# Altium schematic sheet Pg7-Power supply 2.SchDoc: Isolated Poser Supply 1
size 431 x 279 mm; Date: Not shown in title block; ApprovedBy: Not shown in title block; CheckedBy: Not shown in title block; Author: Not shown in title block; CompanyName: Not shown in title block; Engineer: Not shown in title block; Organization: Not shown in title block; Address1: Not shown in title block; Address2: Not shown in title block; Address3: Not shown in title block; Address4: Not shown in title block; DocumentNumber: 5; Revision: Use project parameter SCH_Rev; SheetNumber: 7; SheetTotal: 9; PageSetup: Record=PageOptions|CenterHorizontal=True|CenterVertical=True|PrintScale=0.62|XCorrection=1.00|YCorrection=1.00|PrintKind=0|BorderSize=5000000|LeftOffset=0|BottomOffset=0|Orientation=2|PaperLength=1000|PaperWidth=1000|Scale=100|PaperSource=15|PrintQuality=600|MediaType=1|DitherType=10|PaperKind=Letter|PrintScaleMode=1; CurrentTime: Not shown in title block; CurrentDate: Not shown in title block; Time: Not shown in title block; DocumentFullPathAndName: Not shown in title block; DocumentName: Not shown in title block; ModifiedDate: Not shown in title block; ImagePath: Not shown in title block
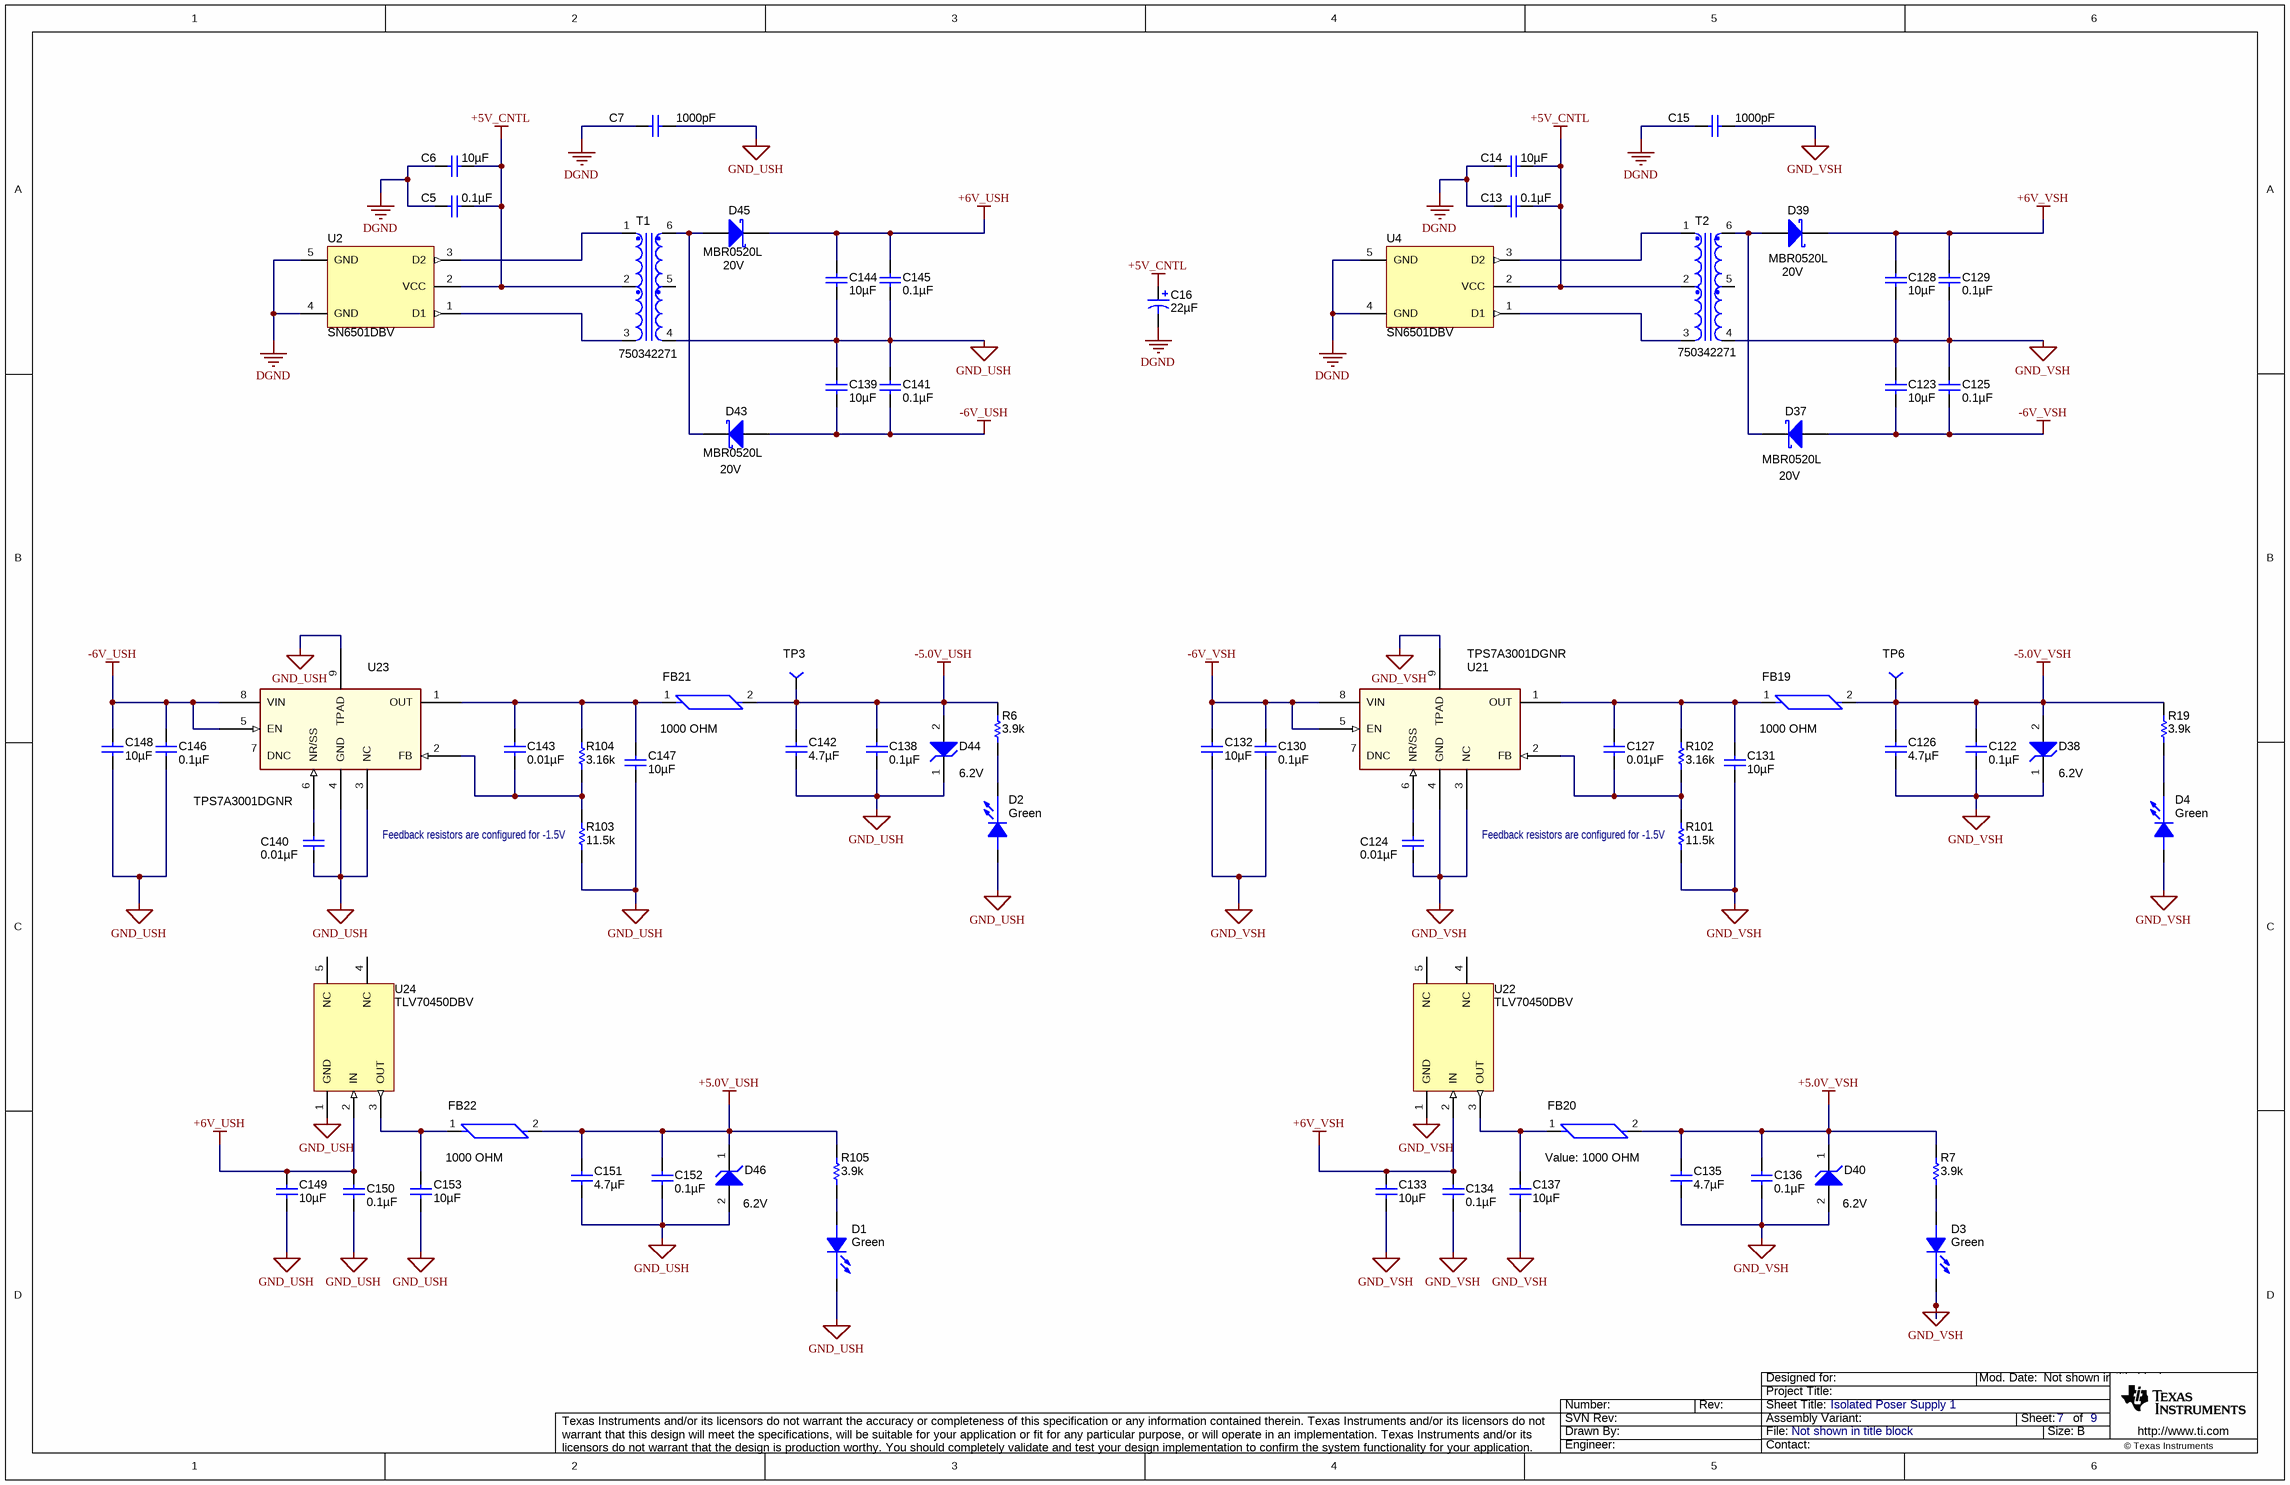
[diagram p0: Pg7-Power supply 2.SchDoc]

## Parts
C5  ValueDisplayed: 0.1µF  [0603]
C6  ValueDisplayed: 10µF  [1210]
C7  value 1000pF  [CAP_200mil]
C13  ValueDisplayed: 0.1µF  [0603]
C14  ValueDisplayed: 10µF  [1210]
C15  value 1000pF  [CAP_200mil]
C16  ValueDisplayed: 22µF  [SM_RADIAL_5MM]  (hidden comment: UUD1E220MCL1GS)
C122  ValueDisplayed: 0.1µF  [0603]
C123  ValueDisplayed: 10µF  [1210]
C124  ValueDisplayed: 0.01µF  [0603]
C125  ValueDisplayed: 0.1µF  [0603]
C126  ValueDisplayed: 4.7µF  [0805_HV]
C127  ValueDisplayed: 0.01µF  [0603]
C128  ValueDisplayed: 10µF  [1210]
C129  ValueDisplayed: 0.1µF  [0603]
C130  ValueDisplayed: 0.1µF  [0603]
C131  ValueDisplayed: 10µF  [1210]
C132  ValueDisplayed: 10µF  [1210]
C133  ValueDisplayed: 10µF  [1210]
C134  ValueDisplayed: 0.1µF  [0603]
C135  ValueDisplayed: 4.7µF  [0805_HV]
C136  ValueDisplayed: 0.1µF  [0603]
C137  ValueDisplayed: 10µF  [1210]
C138  ValueDisplayed: 0.1µF  [0603]
C139  ValueDisplayed: 10µF  [1210]
C140  ValueDisplayed: 0.01µF  [0603]
C141  ValueDisplayed: 0.1µF  [0603]
C142  ValueDisplayed: 4.7µF  [0805_HV]
C143  ValueDisplayed: 0.01µF  [0603]
C144  ValueDisplayed: 10µF  [1210]
C145  ValueDisplayed: 0.1µF  [0603]
C146  ValueDisplayed: 0.1µF  [0603]
C147  ValueDisplayed: 10µF  [1210]
C148  ValueDisplayed: 10µF  [1210]
C149  ValueDisplayed: 10µF  [1210]
C150  ValueDisplayed: 0.1µF  [0603]
C151  ValueDisplayed: 4.7µF  [0805_HV]
C152  ValueDisplayed: 0.1µF  [0603]
C153  ValueDisplayed: 10µF  [1210]
D1  value Green  [LED0603AA]
D2  value Green  [LED0603AA]
D3  value Green  [LED0603AA]
D4  value Green  [LED0603AA]
D37  MBR0520L  value 20V  [SOD-123]
D38  value 6.2V  [powerDI123]
D39  MBR0520L  value 20V  [SOD-123]
D40  value 6.2V  [powerDI123]
D43  MBR0520L  value 20V  [SOD-123]
D44  value 6.2V  [powerDI123]
D45  MBR0520L  value 20V  [SOD-123]
D46  value 6.2V  [powerDI123]
FB19  value 1000 OHM  [FB0603]
FB20  value 1000 OHM  [FB0603]
FB21  value 1000 OHM  [FB0603]
FB22  value 1000 OHM  [FB0603]
R6  value 3.9k  [0603]
R7  value 3.9k  [0603]
R19  value 3.9k  [0603]
R101  value 11.5k  [0603]
R102  ValueDisplayed: 3.16k  [0603]  (hidden comment: RC0603FR-073K16L)
R103  value 11.5k  [0603]
R104  ValueDisplayed: 3.16k  [0603]  (hidden comment: RC0603FR-073K16L)
R105  value 3.9k  [0603]
T1  750342271  [760390015]
T2  750342271  [760390015]
TP3  (no value)  [TP-040_RND]
TP6  (no value)  [TP-040_RND]
U2  SN6501DBV  [DBV0005A_N]
U4  SN6501DBV  [DBV0005A_N]
U21  (no value)  [MSOP8(DGN)]
U22  TLV70450DBV  [DBV0005A_N]
U23  TPS7A3001DGNR  [MSOP8(DGN)]
U24  TLV70450DBV  [DBV0005A_N]

## Nets
+5.0V_USH: C151.2 C152.1 D46.1(K) FB22.2 R105.2
+5.0V_VSH: C135.2 C136.1 D40.1(K) FB20.2 R7.2
+5V_CNTL: C5.2 C6.2 C13.2 C14.2 C16.1(+) T1.2 T2.2 U2.2(VCC) U4.2(VCC)
+6V_USH: C144.1 C145.1 C149.2 C150.1 D45.1(K) U24.2(IN)
+6V_VSH: C128.1 C129.1 C133.2 C134.1 D39.1(K) U22.2(IN)
-5.0V_USH: C138.1 C142.2 D44.2(A) FB21.2 R6.2 TP3.1
-5.0V_VSH: C122.1 C126.2 D38.2(A) FB19.2 R19.2 TP6.1
-6V_USH: C139.2 C141.2 C146.1 C148.2 D43.2(A) U23.5(EN) U23.8(VIN)
-6V_VSH: C123.2 C125.2 C130.1 C132.2 D37.2(A) U21.5(EN) U21.8(VIN)
DGND: C5.1 C6.1 C7.1 C13.1 C14.1 C15.1 C16.2(-) U2.4(GND) U2.5(GND) U4.4(GND) U4.5(GND)
GND_USH: C7.2 C138.2 C139.1 C140.1 C141.1 C142.1 C144.2 C145.2 C146.2 C147.1 C148.1 C149.1 C150.2 C151.1 C152.2 C153.1 D1.1(C) D2.2(A) D44.1(K) D46.2(A) R103.1 T1.4 U23.3(NC) U23.4(GND) U23.9(TPAD) U24.1(GND)
GND_VSH: C15.2 C122.2 C123.1 C124.1 C125.1 C126.1 C128.2 C129.2 C130.2 C131.1 C132.1 C133.1 C134.2 C135.1 C136.2 C137.1 D3.1(C) D4.2(A) D38.1(K) D40.2(A) R101.1 T2.4 U21.3(NC) U21.4(GND) U21.9(TPAD) U22.1(GND)
NetC124_2: C124.2 U21.6(NR/SS)
NetC127_1: C127.1 R101.2 R102.1 U21.2(FB)
NetC127_2: C127.2 C131.2 FB19.1 R102.2 U21.1(OUT)
NetC137_2: C137.2 FB20.1 U22.3(OUT)
NetC140_2: C140.2 U23.6(NR/SS)
NetC143_1: C143.1 R103.2 R104.1 U23.2(FB)
NetC143_2: C143.2 C147.2 FB21.1 R104.2 U23.1(OUT)
NetC153_2: C153.2 FB22.1 U24.3(OUT)
NetD1_2: D1.2(A) R105.1
NetD2_1: D2.1(C) R6.1
NetD3_2: D3.2(A) R7.1
NetD4_1: D4.1(C) R19.1
NetD37_1: D37.1(K) D39.2(A) T2.6
NetD43_1: D43.1(K) D45.2(A) T1.6
NetT1_1: T1.1 U2.3(D2)
NetT1_3: T1.3 U2.1(D1)
NetT2_1: T2.1 U4.3(D2)
NetT2_3: T2.3 U4.1(D1)

Not connected (* = marked no-connect by the designer): T1 5; T2 5; U21 7(DNC); U22 4(NC) 5(NC); U23 7(DNC); U24 4(NC) 5(NC)

## Notes on the sheet
- (near R103) Feedback resistors are configured for -1.5V
- (near R101) Feedback resistors are configured for -1.5V
- Drawn By:
- SVN Rev:
- Number:
- Rev:
- Sheet Title:
- File:
- Project Title:
- Designed for:
- Assembly Variant:
- Mod. Date:
- Sheet:
- Size:
- of
- B
- http://www.ti.com
- Texas Instruments and/or its licensors do not warrant the accuracy or completeness of this specification or any information contained therein. Texas Instruments and/or its licensors do not warrant that this design will meet the specifications, will be suitable for your application or fit for any particular purpose, or will operate in an implementation. Texas Instruments and/or its licensors do not warrant that the design is production worthy. You should completely validate and test your design implementation to confirm the system functionality for your application.
- Engineer:
- Contact:
- © Texas Instruments

## Library data of the parts
C5 C13 C122 C125 C129 C130 C134 C136 C138 C141 C145 C146 C150 C152 = C0603C104K5RACTU: CAP, CERM, 0.1uF, 50V, +/-10%, X7R, 0603; Manufacturer: Kemet; Polarized: N; CompType: Capacitor; U/M: EA; Cap_F: 0.0000001; Tolerance_%: 10; Value1: Unknown; VDC_V: 50; TaMin_C: -55; TaMax_C: 125; SymbolVersion: 2008-07-09; Value: 0.1uF; PartNumber: C0603C104K5RACTU; PackageReference: 0603; RoHS: Y; Value2: 50V; MountType: SMT; Technology: Ceramic; TempCo: X7R; Cap_Case: 0603; Published: 2008-06-19; Publisher: Texas Instruments; LatestRevisionDate: 2013-12-06; ComponentLink1Description: Datasheet link; ComponentLink1URL: http://www.kemet.com/kemet/web/homepage/kechome.nsf/vapubfiles/F3102_Y5V.pdf/$file/F3102_Y5V.pdf; Supplier 1: Digi-Key; Supplier Part Number 1: 399-5089-1-ND; Supplier 2: Mouser; Supplier Part Number 2: 80-C0603C104K5R; Supplier 3: Farnell; Supplier Part Number 3: 1288255
C6 C14 C123 C128 C131-C133 C137 C139 C144 C147-C149 C153 = GMK325AB7106MM-T: CAP, CERM, 10uF, 35V, +/-20%, X7R, 1210; Manufacturer: Taiyo Yuden; Polarized: N; CompType: Capacitor; U/M: EA; Cap_F: 0.00001; Tolerance_%: 20; Value1: Unknown; VDC_V: 35; TaMin_C: -55; TaMax_C: 125; PackageReference: 1210; PartNumber: GMK325AB7106MM-T; SymbolVersion: 2008-07-09; Value: 10uF; RoHS: Y; Value2: 35V; MountType: SMT; Technology: Ceramic; Cap_Case: 1210; Publisher: Texas Instruments; LatestRevisionDate: 2013-12-06; ComponentLink1Description: Datasheet link; ComponentLink1URL: http://www.yuden.co.jp/productdata/catalog/en/mlcc01_e.pdf; Supplier 1: Digi-Key; Supplier Part Number 1: 587-2779-1-ND; Supplier 2: Mouser; Supplier Part Number 2: 963-GMK325AB7106MM-T; Supplier 3: Farnell; Supplier Part Number 3: 1894510; TempCo: X7R; Published: 2008-06-19
C7 C15 = 202R18W102KV4E: CAP CER 1000PF 1KV 10% RADIAL; PartNumber: S102K29Y5PN63J5R; Manufacturer: Vishay BC Components; Polarized: N; CompType: Capacitor; Tolerance_%: 0; ValueDisplayed: 1000pF; RoHS: Y; Value2: 1kv; MountType: radial; Technology: Ceramic; Publisher: Texas Instruments; ComponentLink1Description: Datasheet link; ComponentLink1URL: http://www.johansondielectrics.com/images/stories/catalog/JDI-Product-Catalog.pdf; Supplier 1: Digi-Key; Supplier Part Number 1: 1251PH-ND
C16 = UUD1E220MCL1GS: CAP, AL, 22uF, 25V, +/-20%, 0.76 ohm, SMD; Manufacturer: Nichicon; Polarized: Y; CompType: Capacitor; U/M: EA; Cap_F: 0.000022; Tolerance_%: 20; VDC_V: 25; ESR_Ohm: 0.76; IRMS_A: 0.15; TaMin_C: -55; TaMax_C: 105; Cap_Case: 5x5.8; SymbolVersion: 2008-07-09; Value: 22uF; PartNumber: UUD1E220MCL1GS; PackageReference: 5x5.8; RoHS: Y; Value1: 0.76 ohm; Value2: 25V; MountType: SMT; Technology: AL; Series: uD; Publisher: Texas Instruments; LatestRevisionDate: 2014-01-08; ComponentLink1Description: Datasheet link; ComponentLink1URL: http://products.nichicon.co.jp/en/pdf/XJA043/e-ud.pdf; Supplier 1: Digi-Key; Supplier Part Number 1: 493-2270-1-ND; Supplier 2: Mouser; Supplier Part Number 2: 647-UUD1E220MCL; Supplier 3: Farnell; Supplier Part Number 3: 1899607
C124 C127 C140 C143 = 06031C103JAT2A: CAP, CERM, 0.01uF, 100V, +/-5%, X7R, 0603; PartNumber: 06031C103J4Z4A; Manufacturer: AVX; Polarized: N; CompType: Capacitor; U/M: EA; Cap_F: 0.00000001; Tolerance_%: 5; ESR_Ohm: 0.098; Value1: 0.098 ohm; VDC_V: 100; TaMin_C: -55; TaMax_C: 125; SymbolVersion: 2008-07-09; Value: 0.01uF; PackageReference: 0603; RoHS: Y; Value2: 100V; MountType: SMT; Technology: Ceramic; TempCo: X7R; Cap_Case: 0603; Published: 2008-06-19; Publisher: Texas Instruments; LatestRevisionDate: 2013-11-21; ComponentLink1Description: Datasheet link; ComponentLink1URL: http://www.avx.com/docs/masterpubs/smccp.pdf; Supplier 1: Digi-Key; Supplier Part Number 1: 478-7418-1-ND; Supplier 2: Mouser; Supplier Part Number 2: 581-06031C103J; Supplier 3: Farnell; Supplier Part Number 3: 1833876
C126 C135 C142 C151 = C2012X5R1H475K125AB: CAP, CERM, 4.7uF, 50V, +/-10%, X5R, 0805; Manufacturer: TDK; Polarized: N; CompType: Capacitor; U/M: EA; Cap_F: 0.0000047; Tolerance_%: 10; Value1: Unknown; VDC_V: 50; TaMin_C: -55; TaMax_C: 85; Cap_Case: 0805; PackageReference: 0805; PartNumber: C2012X5R1H475K125AB; SymbolVersion: 2008-07-09; Value: 4.7uF; RoHS: Y; Value2: 50V; MountType: SMT; Technology: Ceramic; Publisher: Texas Instruments; LatestRevisionDate: 2013-12-06; ComponentLink1Description: Datasheet link; ComponentLink1URL: http://product.tdk.com/capacitor/mlcc/en/productguide/pdf/mlcc_selection_guide_en_03.pdf; Supplier 1: Digi-Key; Supplier Part Number 1: 445-5980-1-ND; TempCo: X5R; Published: 2008-06-19
D1-D4 = LED_LG L29K-G2J1-24-Z: LED SmartLED Green 570NM; Manufacturer: OSRAM; SymbolCreator: x0120606; CompType: *; PartNumber: LG L29K-G2J1-24-Z; Alternate Manufacturer: LED; PackageReference: 0603; ComponentLink1URL: http://catalog.osram-os.com/catalogue/catalogue.do;jsessionid=32CB61882C089EDD4B6D0A54E7E1F117?act=downloadFile&favOid=020000020000138e000100b6; Alternate PartNumber: *; ComponentLink1Description: Datasheet link; Supplier Part Number 1: 475-2709-2-ND; Supplier 1: Digi-Key; MountType: SMT; Publisher: TI
D37 D39 D43 D45 = MBR0520LT1G: Diode, Schottky, 20V, 0.5A, SOD-123; Manufacturer: Fairchild Semiconductor; U/M: EA; Vf_V: 0.385; Value2: 0.385V; Io_A: 0.5; Vr_V: 20; TJmax_C: 125; RJC_CperW: 150; CompType: Diode; SymbolVersion: 2008-12-08; PartNumber: MBR0520L; PackageReference: SOD-123; Value1: 0.5A; MountType: SMT; Type: Schottky; RoHS: Y; Published: 2008-06-26; Publisher: Texas Instruments; LatestRevisionDate: 2013-12-18; ComponentLink1Description: Datasheet link; ComponentLink1URL: http://www.onsemi.com/pub_link/Collateral/MBR0520LT1-D.PDF; Supplier 1: Digi-Key; Supplier Part Number 1: MBR0520LCT-ND; Supplier 2: Mouser; Supplier Part Number 2: 863-MBR0520LT1G; Supplier 3: Farnell; Supplier Part Number 3: 9556915
D38 D40 D44 D46 = DFLZ6V2-7: Diode, Zener, 6.2V, 1W, PowerDI123; Manufacturer: Diodes Inc.; U/M: EA; Power_W: 1; Vz_V: 6.2; RJA_CperW: 110; CompType: Zener; SymbolVersion: 2010-08-25; PartNumber: DFLZ6V2-7; PackageReference: PowerDI123; Vr_V: N/A; Value1: 1W; MountType: SMT; RoHS: Y; ComponentLink1Description: Datasheet link; ComponentLink1URL: http://www.diodes.com/datasheets/ds30464.pdf; Published: 2008-10-08; Publisher: Texas Instruments; LatestRevisionDate: 2013-11-26; LatestRevisionNote: Updated Supplier Data; Supplier 1: Digi-Key; Supplier Part Number 1: DFLZ6V2DICT-ND; Supplier 2: Mouser; Supplier Part Number 2: 621-DFLZ6V2-7; Supplier 3: Farnell; Supplier Part Number 3: 2077983
FB19-FB22 = MMZ1608B102C: FERRITE CHIP 1000 OHM 300MA 0603; Manufacturer: TDK Corporation; CompType: Ferrite Bead; PartNumber: MMZ1608B102C; MountType: SMT; Alternate PartNumber: *; Supplier 1: Digi-Key; ComponentLink1URL: http://www.tdk.co.jp/tefe02/e9412_mmz.pdf; ComponentLink1Description: Datasheet link; Publisher: TI; Supplier Part Number 1: 445-8672-1-ND; PackageReference: 0603; Alternate Manufacturer: *; RoHS: Y
R6 R7 R19 R105 = CRCW06033K90JNEA: RES, 3.9k ohm, 5%, 0.1W, 0603; Manufacturer: Vishay-Dale; CompType: Resistor; Res_ohm: 3900; Value_Code: 3k90; Tolerance_%: 5; Power_W: 0.1; VDC_V: 75; TempCo: 200 ppm/C; EIA_Code: E24; U/M: EA; SymbolVersion: 2009-05-29; PartNumber: CRCW06033K90JNEA; PackageReference: 0603; RoHS: Y; Value1: 5%; Value2: 0.1W; MountType: SMT; Technology: Thick Film; Published: 2008-06-26; Publisher: Texas Instruments; LatestRevisionDate: 2013-10-22; ComponentLink1Description: Datasheet link; ComponentLink1URL: http://www.vishay.com/docs/20035/dcrcwe3.pdf; Supplier 1: Digi-Key; Supplier Part Number 1: 541-3.9KGCT-ND; Supplier 2: Farnell; Supplier Part Number 2: 1563917; Supplier 3: Newark; Supplier Part Number 3: 72M6834
R101 R103 = CRCW060311K5FKEA: RES, 11.5k ohm, 1%, 0.1W, 0603; Manufacturer: Vishay-Dale; CompType: Resistor; Res_ohm: 11500; Value_Code: 11k5; Tolerance_%: 1; Power_W: 0.1; VDC_V: 75; TempCo: 100 ppm/C; EIA_Code: E96; U/M: EA; SymbolVersion: 2009-05-29; PartNumber: CRCW060311K5FKEA; PackageReference: 0603; RoHS: Y; Value1: 1%; Value2: 0.1W; MountType: SMT; Technology: Thick Film; Published: 2008-06-26; Publisher: Texas Instruments; LatestRevisionDate: 2013-10-22; ComponentLink1Description: Datasheet link; ComponentLink1URL: http://www.vishay.com/docs/20035/dcrcwe3.pdf; Supplier 1: Digi-Key; Supplier Part Number 1: 541-11.5KHCT-ND; Supplier 2: Mouser; Supplier Part Number 2: 71-CRCW0603-11.5K-E3; Supplier 3: Farnell; Supplier Part Number 3: 1469753
R102 R104 = RC0603FR-073K16L: RES, 3.16 k, 1%, 0.1 W, 0603; Manufacturer: Yageo America; CompType: Resistor; Value: 3.16k; Res_ohm: 3160; Value_Code: 3k16; Tolerance_%: 1; Power_W: 0.1; Value2: 0.1W; VDC_V: 150; TempCo: 200 ppm/C; EIA_Code: E96; U/M: EA; SymbolVersion: 2009-05-29; PartNumber: RC0603FR-073K16L; PackageReference: 0603; RoHS: Y; Value1: 1%; MountType: SMT; Technology: Thick Film; Published: 2008-06-26; Publisher: Texas Instruments; LatestRevisionDate: 2015-08-12; ComponentLink1Description: Datasheet link; ComponentLink1URL: http://www.yageo.com/pdf/Pu-RC0603_51_PbFree_L_2.pdf; Supplier 1: Digi-Key; Supplier Part Number 1: 311-3.16KHRCT-ND; Supplier 2: Mouser; Supplier Part Number 2: 603-RC0603FR-073K16L; Supplier 3: Farnell; Supplier Part Number 3: 9238549
T1 T2 = TRNSFMR: Transformer 469uH SMD; Manufacturer: Wurth Electronics Midcom; Alternate Manufacturer: *; RoHS: Y; Value: 469uH; MountType: SMT; PartNumber: 750342271; PackageReference: 10.05mm L x 6.73mm W; Publisher: TI; ComponentLink1Description: Datasheet Link; Alternate PartNumber: *; CompType: Transformer; Supplier 1: Digi-Key
TP3 TP6 = TP-040_RND: Test Point, O.040 Hole; Manufacturer: STD; Value: STD; area: *; SymbolVersion: 06/30/2008 16:03:57; PartNumber: STD; ComponentLink1Description: AEO Datasheet Link
U2 U4 = SN6501DBV: Transformer Driver for Isolated Power Supplies, DBV0005A; Alternate Manufacturer: None; Manufacturer: Texas Instruments; SymbolCreator: a0411947; CompType: IC; U/M: EA; SymbolVersion: 2013-06-28; PartNumber: SN6501DBV; PackageReference: DBV0005A; MountType: SMT; ComponentLink1Description: Datasheet Link; ComponentLink1URL: http://www.ti.com/lit/ds/symlink/sn6501.pdf; RoHS: Y; Publisher: Texas Instruments; LatestRevisionDate: 2013-12-23
U21 U23 = TPS7A3001DGNR: -36V, -200mA, Ultralow-Noise, Negative Linear Regulator; Alternate Manufacturer: None; Manufacturer: Texas Instruments; CompType: IC; SymbolCreator: x0120606; ComponentLink1URL: http://www.ti.com/lit/ds/symlink/tps7a3001.pdf; ComponentLink1Description: Datasheet Link; Publisher: Texas Instruments; PackageReference: MSOP-PowerPAD (DGN) | 8; RoHS: Y; PartNumber: TPS7A3001DGNR; MountType: SMT
U22 U24 = TLV70450DBV: Regulator, LDO, 5V, 0.15A, SOT23-5; Alternate Manufacturer: None; Manufacturer: Texas Instruments; SymbolCreator: x0120606; CompType: IC; PartNumber: TLV70450DBV; PackageReference: DBV0005A; MountType: SMT; ComponentLink1Description: Datasheet Link; ComponentLink1URL: http://www.ti.com/lit/ds/symlink/tlv70450.pdf; RoHS: Y; Publisher: Texas Instruments